# Altium schematic sheet 1_Wearable Air Quality Pendant.schdoc
size 289 x 200 mm; Name: default297x210; Symbol: default297x210; Device: default297x210; Size: "A4"; Id: /; File: Wearable Air Quality Pendant; Sheet: /
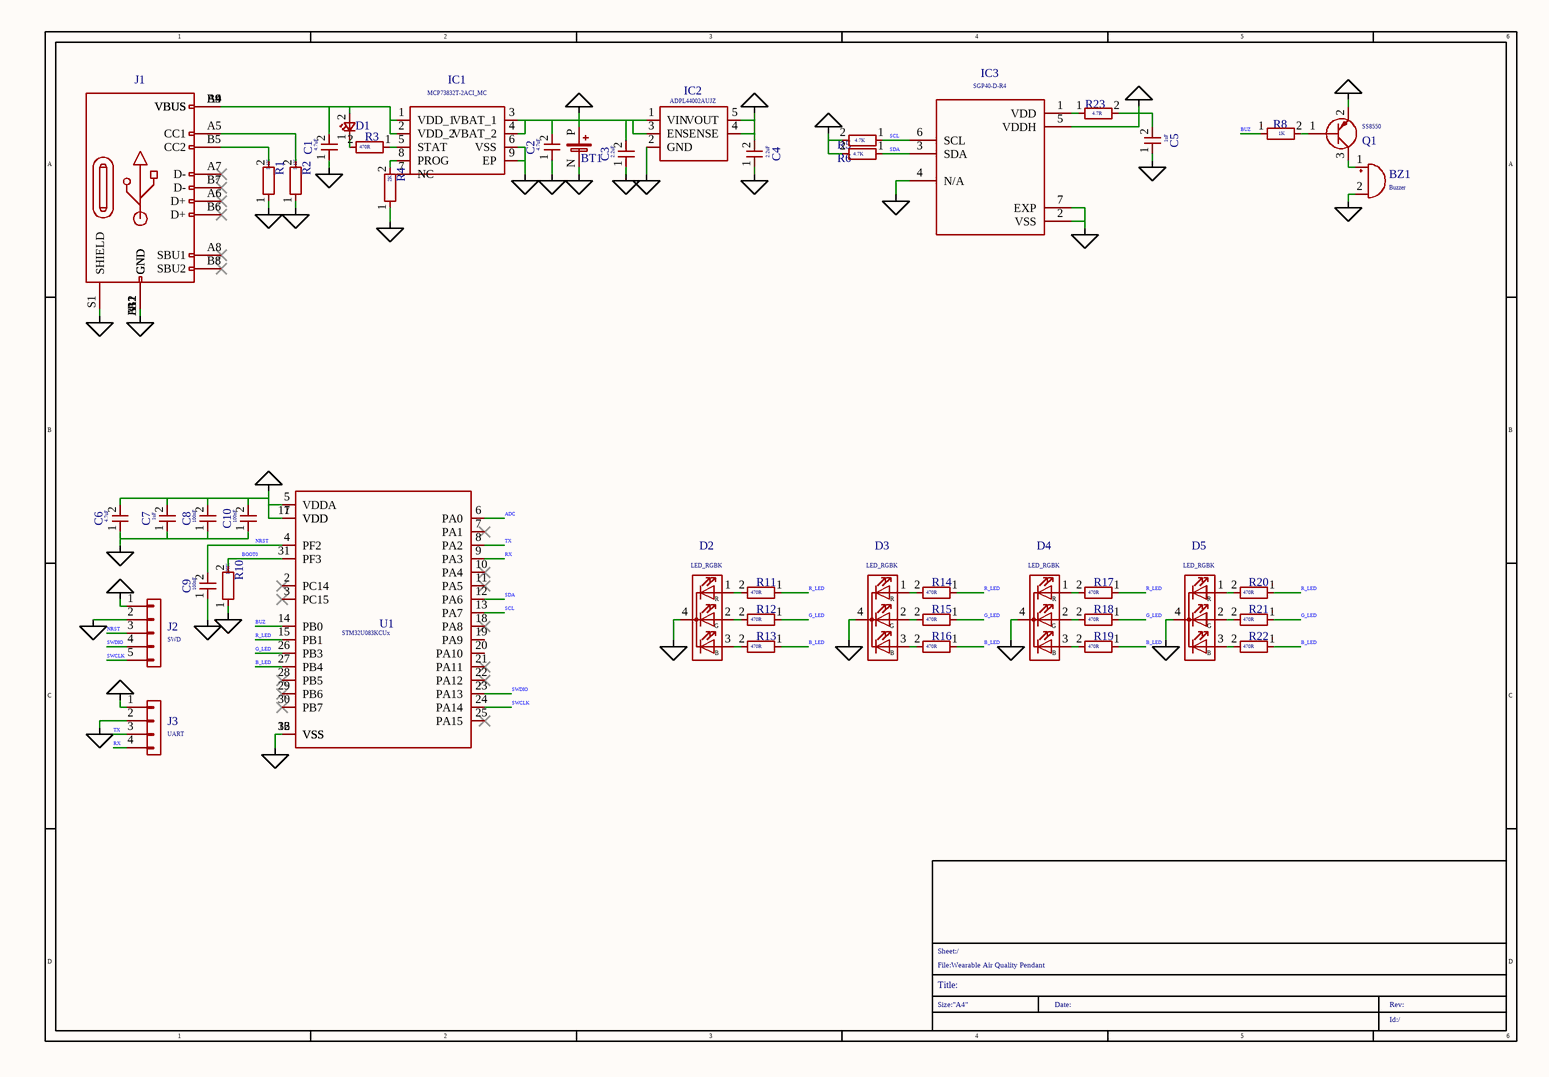
[diagram p0: 1_Wearable Air Quality Pendant.schdoc]

## Parts
BT1  Device_Battery_Cell  [1060:BAT_1060]  (value not drawn)
BZ1  value Buzzer  [PKMCS0909E4000_R1:PKMCS0909E4000-R1_MUR]  (hidden comment: Device_Buzzer)
C1  value 4.7uF  [Capacitor_SMD:C_0603_1608Metric]  (hidden comment: Device_C_Small)
C2  value 4.7uF  [Capacitor_SMD:C_0603_1608Metric]  (hidden comment: Device_C_Small)
C3  value 2.2uF  [Capacitor_SMD:C_0603_1608Metric]  (hidden comment: Device_C_Small)
C4  value 2.2uF  [Capacitor_SMD:C_0603_1608Metric]  (hidden comment: Device_C_Small)
C5  value 1uF  [Capacitor_SMD:C_0603_1608Metric]  (hidden comment: Device_C_Small)
C6  value 4.7uF  [Capacitor_SMD:C_0603_1608Metric]  (hidden comment: Device_C_Small)
C7  value 1uF  [Capacitor_SMD:C_0603_1608Metric]  (hidden comment: Device_C_Small)
C8  value 100nF  [Capacitor_SMD:C_0603_1608Metric]  (hidden comment: Device_C_Small)
C9  value 100nF  [Capacitor_SMD:C_0603_1608Metric]  (hidden comment: Device_C_Small)
C10  value 100nF  [Capacitor_SMD:C_0603_1608Metric]  (hidden comment: Device_C_Small)
D1  Device_LED_Small  [LED_SMD:LED_0603_1608Metric]  (value not drawn)
D2  value LED_RGBK  [EAST1616RGBA1:EAST1616RGBA1]  (hidden comment: Device_LED_RGBK)
D3  value LED_RGBK  [EAST1616RGBA1:EAST1616RGBA1]  (hidden comment: Device_LED_RGBK)
D4  value LED_RGBK  [EAST1616RGBA1:EAST1616RGBA1]  (hidden comment: Device_LED_RGBK)
D5  value LED_RGBK  [EAST1616RGBA1:EAST1616RGBA1]  (hidden comment: Device_LED_RGBK)
IC1  value MCP73832T-2ACI_MC  [MCP73832T-2ACI_MC:SON50P300X200X100-9N-D]  (hidden comment: MCP73832T-2ACI_MC_MCP73832T-2ACI_MC)
IC2  value ADPL44002AUJZ  [ADPL44002AUJZ-3.3-R7:SOT95P280X100-5N]  (hidden comment: ADPL44002AUJZ-3_3-R7_ADPL44002AUJZ-3.3-R7)
IC3  value SGP40-D-R4  [SGP40_D_R4:XCDR_SGP40-D-R4]  (hidden comment: SGP40-D-R4_SGP40-D-R4)
J1  Connector_USB_C_Receptacle_USB2.0_16P  [Connector_USB:USB_C_Receptacle_Palconn_UTC16-G]  (value not drawn)
J2  value SWD  [Connector_PinHeader_1.27mm:PinHeader_1x06_P1.27mm_Vertical]  (hidden comment: Connector_Generic_Conn_01x05)
J3  value UART  [Connector_PinHeader_1.27mm:PinHeader_1x04_P1.27mm_Vertical]  (hidden comment: Connector_Generic_Conn_01x04)
Q1  value SS8550  [Package_TO_SOT_SMD:SOT-23]  (hidden comment: Transistor_BJT_SS8550)
R1  value 5.1K  [Resistor_SMD:R_0603_1608Metric]  (hidden comment: Device_R)
R2  value 5.1K  [Resistor_SMD:R_0603_1608Metric]  (hidden comment: Device_R)
R3  value 470R  [Resistor_SMD:R_0603_1608Metric]  (hidden comment: Device_R)
R4  value 2K  [Resistor_SMD:R_0603_1608Metric]  (hidden comment: Device_R)
R5  value 4.7K  [Resistor_SMD:R_0603_1608Metric]  (hidden comment: Device_R)
R6  value 4.7K  [Resistor_SMD:R_0603_1608Metric]  (hidden comment: Device_R)
R8  value 1K  [Resistor_SMD:R_0603_1608Metric]  (hidden comment: Device_R)
R10  value 100K  [Resistor_SMD:R_0603_1608Metric]  (hidden comment: Device_R)
R11  value 470R  [Resistor_SMD:R_0603_1608Metric]  (hidden comment: Device_R)
R12  value 470R  [Resistor_SMD:R_0603_1608Metric]  (hidden comment: Device_R)
R13  value 470R  [Resistor_SMD:R_0603_1608Metric]  (hidden comment: Device_R)
R14  value 470R  [Resistor_SMD:R_0603_1608Metric]  (hidden comment: Device_R)
R15  value 470R  [Resistor_SMD:R_0603_1608Metric]  (hidden comment: Device_R)
R16  value 470R  [Resistor_SMD:R_0603_1608Metric]  (hidden comment: Device_R)
R17  value 470R  [Resistor_SMD:R_0603_1608Metric]  (hidden comment: Device_R)
R18  value 470R  [Resistor_SMD:R_0603_1608Metric]  (hidden comment: Device_R)
R19  value 470R  [Resistor_SMD:R_0603_1608Metric]  (hidden comment: Device_R)
R20  value 470R  [Resistor_SMD:R_0603_1608Metric]  (hidden comment: Device_R)
R21  value 470R  [Resistor_SMD:R_0603_1608Metric]  (hidden comment: Device_R)
R22  value 470R  [Resistor_SMD:R_0603_1608Metric]  (hidden comment: Device_R)
R23  value 4.7R  [Resistor_SMD:R_0805_2012Metric]  (hidden comment: Device_R)
U1  value STM32U083KCUx  [Package_DFN_QFN:QFN-32-1EP_5x5mm_P0.5mm_EP3.45x3.45mm]  (hidden comment: MCU_ST_STM32U0_STM32U083KCUx)

## Nets
POWER_+3.3V: C4.2 C5.2 C6.2 C7.2 C8.2 C10.2 IC2.4(SENSE) IC2.5(VOUT) IC3.5(VDDH) J2.1(Pin_1) J3.1(Pin_1) Q1.2(E) R5.2 R6.2 R23.2 U1.1(VDD) U1.5(VDDA) U1.17(VDD)
POWER_+BATT: BT1.P(+) C2.2 C3.2 IC1.3(VBAT_1) IC1.4(VBAT_2) IC2.1(VIN) IC2.3(EN)
POWER_GND: BT1.N(-) BZ1.2(-) C1.1 C2.1 C3.1 C4.1 C5.1 C6.1 C7.1 C8.1 C9.1 C10.1 D2.4(K) D3.4(K) D4.4(K) D5.4(K) IC1.6(VSS) IC1.9(EP) IC2.2(GND) IC3.2(VSS) IC3.4(N/A) IC3.7(EXP) J1.A1(GND) J1.A12(GND) J1.B1(GND) J1.B12(GND) J1.S1(SHIELD) J2.2(Pin_2) J3.2(Pin_2) R1.1 R2.1 R4.1 R10.1 U1.16(VSS) U1.32(VSS) U1.33(VSS)
ADC: U1.6(PA0)
B_LED: R13.1 R16.1 R19.1 R22.1 U1.27(PB4)
BOOT0: R10.2 U1.31(PF3)
BUZ: R8.1 U1.14(PB0)
G_LED: R12.1 R15.1 R18.1 R21.1 U1.26(PB3)
NRST: C9.2 J2.3(Pin_3) U1.4(PF2)
R_LED: R11.1 R14.1 R17.1 R20.1 U1.15(PB1)
RX: J3.4(Pin_4) U1.9(PA3)
SCL: IC3.6(SCL) R5.1 U1.13(PA7)
SDA: IC3.3(SDA) R6.1 U1.12(PA6)
SWCLK: J2.5(Pin_5) U1.24(PA14)
SWDIO: J2.4(Pin_4) U1.23(PA13)
TX: J3.3(Pin_3) U1.8(PA2)
NetBZ1_1: BZ1.1(+) Q1.3(C)
NetC1_2: C1.2 D1.2(A) IC1.1(VDD_1) IC1.2(VDD_2) J1.A4(VBUS) J1.A9(VBUS) J1.B4(VBUS) J1.B9(VBUS)
NetD1_1: D1.1(K) R3.2
NetD2_1: D2.1(RA) R11.2
NetD2_2: D2.2(GA) R12.2
NetD2_3: D2.3(BA) R13.2
NetD3_1: D3.1(RA) R14.2
NetD3_2: D3.2(GA) R15.2
NetD3_3: D3.3(BA) R16.2
NetD4_1: D4.1(RA) R17.2
NetD4_2: D4.2(GA) R18.2
NetD4_3: D4.3(BA) R19.2
NetD5_1: D5.1(RA) R20.2
NetD5_2: D5.2(GA) R21.2
NetD5_3: D5.3(BA) R22.2
NetIC1_5: IC1.5(STAT) R3.1
NetIC1_8: IC1.8(PROG) R4.2
NetIC3_1: IC3.1(VDD) R23.1
NetJ1_A5: J1.A5(CC1) R2.2
NetJ1_B5: J1.B5(CC2) R1.2
NetQ1_1: Q1.1(B) R8.2

Not connected (* = marked no-connect by the designer): IC1 7(NC); J1 A6(D+)* A7(D-)* A8(SBU1)* B6(D+)* B7(D-)* B8(SBU2)*; U1 2(PC14)* 3(PC15)* 7(PA1)* 10(PA4)* 11(PA5)* 18(PA8)* 19(PA9) 20(PA10) 21(PA11)* 22(PA12)* 25(PA15)* 28(PB5)* 29(PB6)* 30(PB7)*

## Notes on the sheet
- 1
- 2
- 3
- 4
- 5
- 6
- A
- B
- C
- D
- File:Wearable Air Quality Pendant
- Sheet:/
- Size:"A4"
- Title:
- Date:
- Rev:
- Id:/
- (in symbol Device_LED_RGBK) R; G; B

## Library data of the parts
BT1 = Device_Battery_Cell: Attribute1: The rectangle area in the assembly layer denotes the zone for optional adhesive fixation.; Add into BOM: yes; Symbol: Device_Battery_Cell; Device: Device_Battery_Cell; Value: Battery_Cell; User doc link: ~; Convert to PCB: yes; Origin Footprint: 1060:BAT_1060
BZ1 = Device_Buzzer: Attribute1: BZ1; ki_fp_filters: *Buzzer*; Add into BOM: yes; Symbol: Device_Buzzer; Device: Device_Buzzer; User doc link: ~; Convert to PCB: yes; Origin Footprint: PKMCS0909E4000_R1:PKMCS0909E4000-R1_MUR
C1-C10 = Device_C_Small: Attribute1: C5; ki_fp_filters: C_*; Add into BOM: yes; Symbol: Device_C_Small; Device: Device_C_Small; User doc link: ~; Convert to PCB: yes; Origin Footprint: Capacitor_SMD:C_0603_1608Metric
D1 = Device_LED_Small: Attribute1: D1; Sim_Pin: 1=K 2=A; ki_fp_filters: LED* LED_SMD:* LED_THT:*; Add into BOM: yes; Symbol: Device_LED_Small; Device: Device_LED_Small; Value: LED_Small; User doc link: ~; Convert to PCB: yes; Origin Footprint: LED_SMD:LED_0603_1608Metric; Sim.Pin: 1=K 2=A
D2-D5 = Device_LED_RGBK: Attribute1: D4; ki_fp_filters: LED* LED_SMD:* LED_THT:*; Add into BOM: yes; Symbol: Device_LED_RGBK; Device: Device_LED_RGBK; User doc link: ~; Convert to PCB: yes; Origin Footprint: EAST1616RGBA1:EAST1616RGBA1
IC1 = MCP73832T-2ACI_MC_MCP73832T-2ACI_MC: Manufacturer_Name: Microchip; Manufacturer_Part_Number: MCP73832T-2ACI/MC; Attribute1: IC1; Add into BOM: yes; Symbol: MCP73832T-2ACI_MC_MCP73832T-2ACI_MC; Device: MCP73832T-2ACI_MC_MCP73832T-2ACI_MC; Datasheet: http://ww1.microchip.com/downloads/en/DeviceDoc/20001984g.pdf; Height: 1; Mouser Part Number: 579-MCP73832T-2ACIMC; Mouser Price/Stock: https://www.mouser.co.uk/ProductDetail/Microchip-Technology/MCP73832T-2ACI-MC?qs=yUQqVecv4qsHSZ5q80S33Q%3D%3D; User doc link: http://ww1.microchip.com/downloads/en/DeviceDoc/20001984g.pdf; Convert to PCB: yes; Origin Footprint: MCP73832T-2ACI_MC:SON50P300X200X100-9N-D
IC2 = ADPL44002AUJZ-3_3-R7_ADPL44002AUJZ-3.3-R7: Manufacturer_Name: Analog Devices; Manufacturer_Part_Number: ADPL44002AUJZ2.5-R7; Attribute1: IC2; Add into BOM: yes; Symbol: ADPL44002AUJZ-3_3-R7_ADPL44002AUJZ-3.3-R7; Device: ADPL44002AUJZ-3_3-R7_ADPL44002AUJZ-3.3-R7; Datasheet: https://www.analog.com/ADPL44002/datasheet; Height: 1; User doc link: https://www.analog.com/ADPL44002/datasheet; Convert to PCB: yes; Origin Footprint: ADPL44002AUJZ-3.3-R7:SOT95P280X100-5N
IC3 = SGP40-D-R4_SGP40-D-R4: MANUFACTURER: Sensirion AG; Add into BOM: yes; Symbol: SGP40-D-R4_SGP40-D-R4; Device: SGP40-D-R4_SGP40-D-R4; PARTREV: 1.2; SNAPEDA_PN: SGP40-D-R4; MAXIMUM_PACKAGE_HEIGHT: 0.95mm; STANDARD: Manufacturer Recommendations; Convert to PCB: yes; Origin Footprint: SGP40_D_R4:XCDR_SGP40-D-R4
J1 = Connector_USB_C_Receptacle_USB2.0_16P: Attribute1: PCB Edge; Attribute2: J1; ki_fp_filters: USB*C*Receptacle*; Add into BOM: yes; Symbol: Connector_USB_C_Receptacle_USB2.0_16P; Device: Connector_USB_C_Receptacle_USB2.0_16P; Datasheet: https://www.usb.org/sites/default/files/documents/usb_type-c.zip; Value: USB_C_Receptacle_USB2.0_16P; User doc link: https://www.usb.org/sites/default/files/documents/usb_type-c.zip; Convert to PCB: yes; Origin Footprint: Connector_USB:USB_C_Receptacle_Palconn_UTC16-G
J2 = Connector_Generic_Conn_01x05: Attribute1: J2; ki_fp_filters: Connector*:*_1x??_*; Add into BOM: yes; Symbol: Connector_Generic_Conn_01x05; Device: Connector_Generic_Conn_01x05; User doc link: ~; Convert to PCB: yes; Origin Footprint: Connector_PinHeader_1.27mm:PinHeader_1x06_P1.27mm_Vertical
J3 = Connector_Generic_Conn_01x04: Attribute1: J3; ki_fp_filters: Connector*:*_1x??_*; Add into BOM: yes; Symbol: Connector_Generic_Conn_01x04; Device: Connector_Generic_Conn_01x04; User doc link: ~; Convert to PCB: yes; Origin Footprint: Connector_PinHeader_1.27mm:PinHeader_1x04_P1.27mm_Vertical
Q1 = Transistor_BJT_SS8550: Attribute1: Q1; ki_fp_filters: SOT?23*; Add into BOM: yes; Symbol: Transistor_BJT_SS8550; Device: Transistor_BJT_SS8550; Datasheet: http://www.secosgmbh.com/datasheet/products/SSMPTransistor/SOT-23/SS8550.pdf; User doc link: http://www.secosgmbh.com/datasheet/products/SSMPTransistor/SOT-23/SS8550.pdf; Convert to PCB: yes; Origin Footprint: Package_TO_SOT_SMD:SOT-23
R1-R6 R8 R10-R22 = Device_R: Attribute1: R8; ki_fp_filters: R_*; Add into BOM: yes; Symbol: Device_R; Device: Device_R; User doc link: ~; Convert to PCB: yes; Origin Footprint: Resistor_SMD:R_0603_1608Metric
R23 = Device_R: Attribute1: R23; ki_fp_filters: R_*; Add into BOM: yes; Symbol: Device_R; Device: Device_R; User doc link: ~; Convert to PCB: yes; Origin Footprint: Resistor_SMD:R_0805_2012Metric
U1 = MCU_ST_STM32U0_STM32U083KCUx: Attribute1: U1; ki_fp_filters: QFN*1EP*5x5mm*P0.5mm*; Add into BOM: yes; Symbol: MCU_ST_STM32U0_STM32U083KCUx; Device: MCU_ST_STM32U0_STM32U083KCUx; Datasheet: https://www.st.com/resource/en/datasheet/stm32u083kc.pdf; User doc link: https://www.st.com/resource/en/datasheet/stm32u083kc.pdf; Convert to PCB: yes; Origin Footprint: Package_DFN_QFN:QFN-32-1EP_5x5mm_P0.5mm_EP3.45x3.45mm